# Altium schematic sheet [3]mic.SchDoc
size A
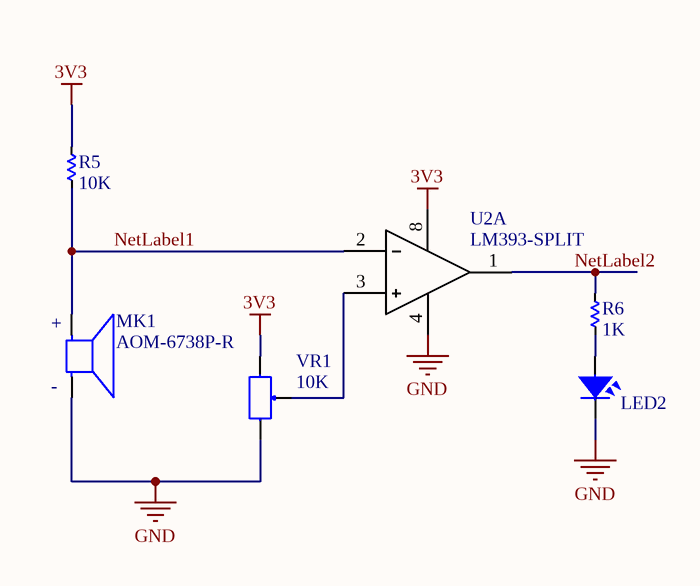
[diagram p0: [3]mic.SchDoc]

## Parts
LED2  LED  [LED-0805-Green]  (value not drawn)
MK1  AOM-6738P-R  [MIC_AOM-6738P-R]
R5  10K  [RES-SMD-0805]
R6  1K  [RES-SMD-0805]
U2  LM393-SPLIT  [SO8]  (part A of 2)
VR1  10K  [VR]

## Nets
3V3: R5.1 U2.8(Vcc+) VR1.1
GND: LED2.2 MK1.N(NEG) U2.4(Vcc-) VR1.3
NetLabel1: MK1.P(POS) R5.2 U2.2
NetLabel2: R6.1 U2.1
NetLED2_1: LED2.1 R6.2
NetU2_3: U2.3 VR1.2

## Notes on the sheet
- (in symbol AOM-6738P-R) +; -

## Library data of the parts
LED2 = LED SMD: Value: LED 3 - 5 ly 2 Colour
MK1 = AOM-6738P-R: MICROPHONE -38DB1.5VDC .5MA 2.2KOHM; MF: PUI; MP: AOM-6738P-R; SnapEDA_Link: https://www.snapeda.com/parts/AOM-6738P-R/PUI+Audio%252C+Inc./view-part/?ref=snap; Purchase-URL: https://pricing.snapeda.com/search/part/AOM-6738P-R/?ref=eda; Value: *; Package: None; Price: None; Availability: In Stock; Check_prices: https://www.snapeda.com/parts/AOM-6738P-R/PUI+Audio%252C+Inc./view-part/?ref=eda
R5 R6 = Res-SMD: Resistor; Manufacturer: Generic Components; Class: Passive; Published: 08/06/2000; Publisher: Altium Hobart Technology Centre
U2 = LM393-SPLIT: IC DUAL COMPARATOR; Supplier 1: Digi-Key; Supplier Part Number 1: LM393MXFSDKR-ND
VR1 = VR: Var Resistor; Value: VR 10K